# EAGLE design BluetoothModulePCBv2 (EAGLE 8.0.2)
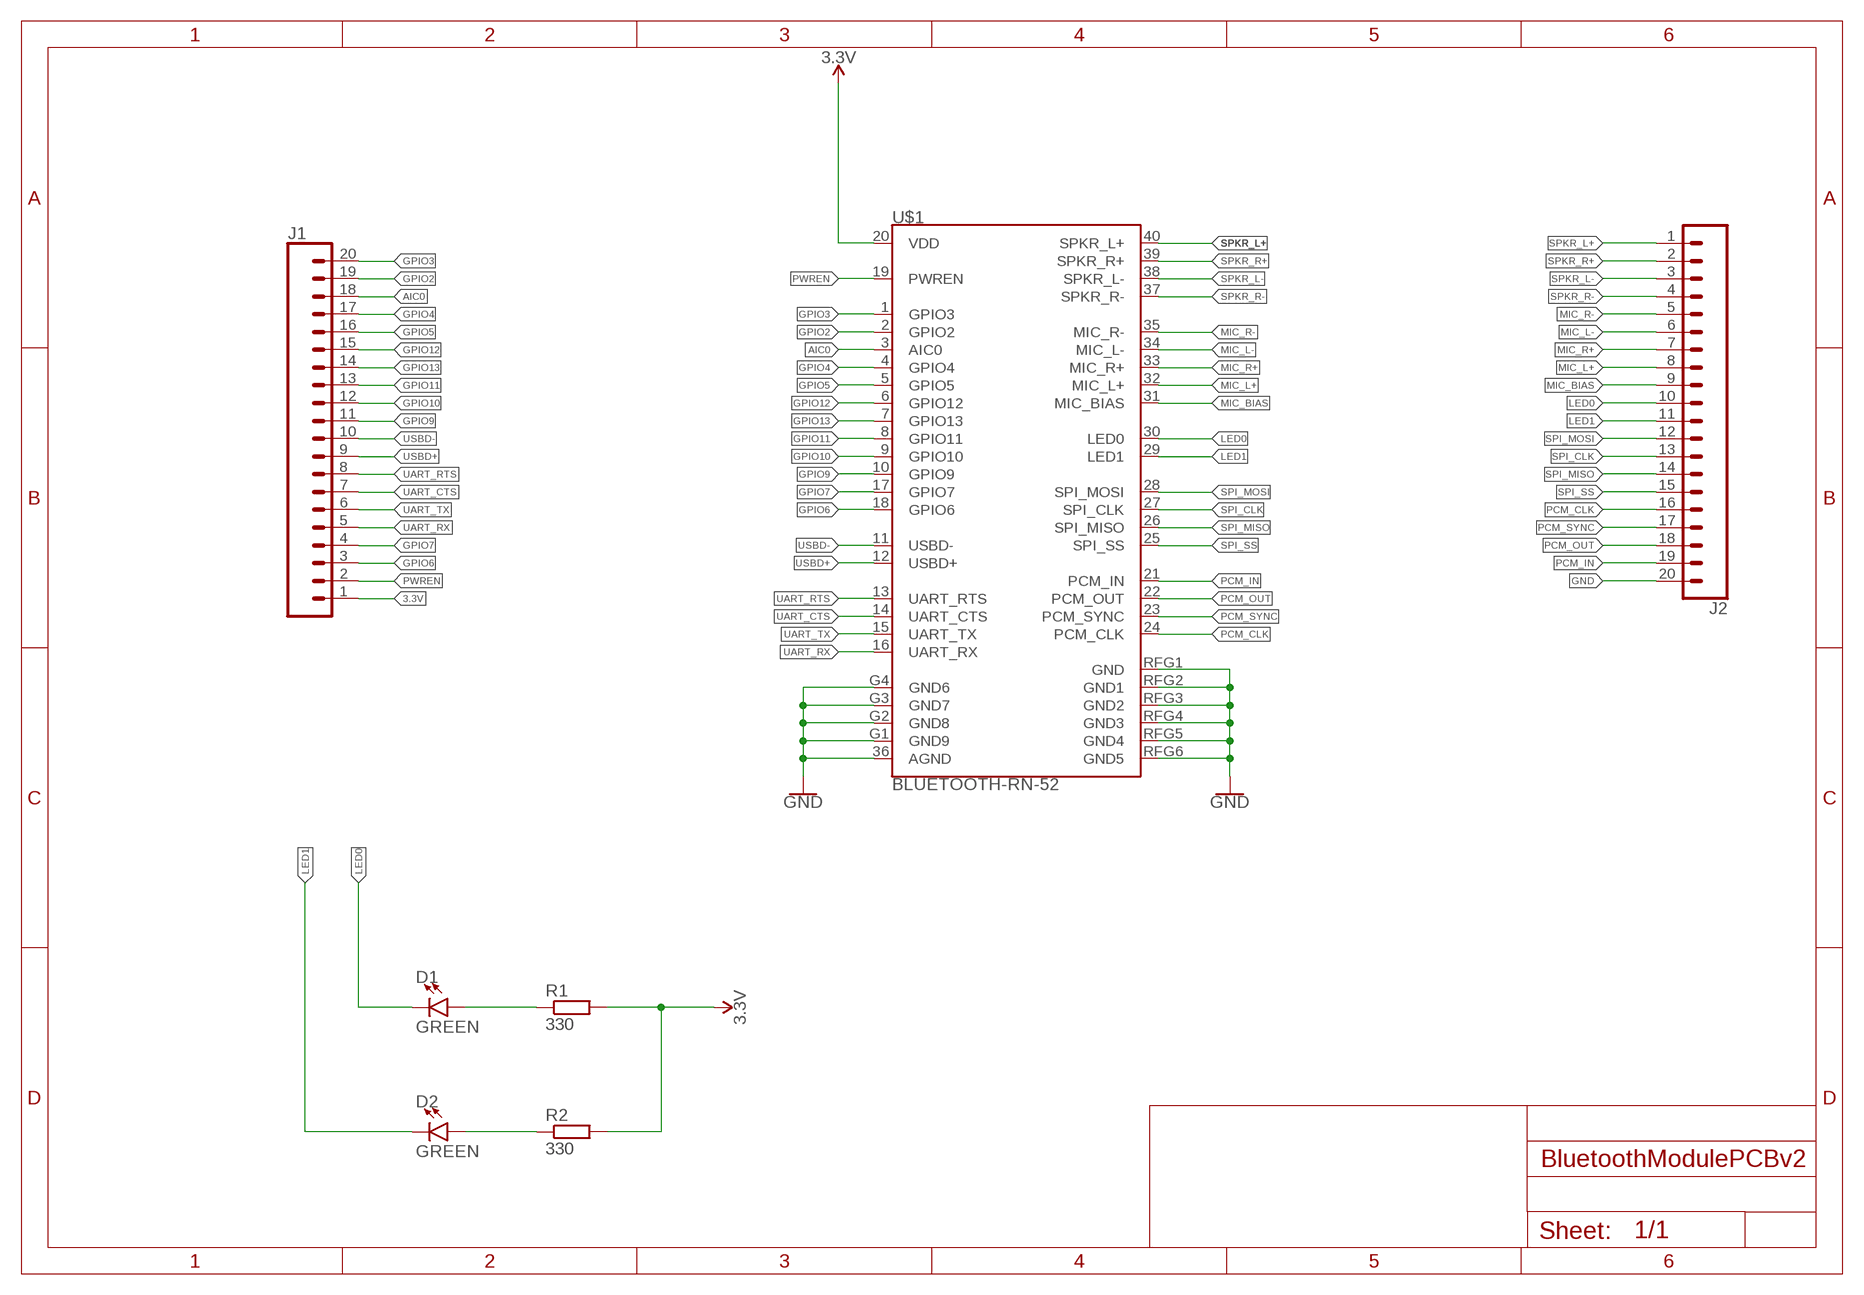
[diagram p0: schematic, sheet 1]

## Parts
D1  GREEN  LED3MM  [LED_3MM]
D2  GREEN  LED3MM  [LED_3MM]
J1  CONN_20  [1X20]
J2  CONN_20  [1X20]
R1  330  R-EU_0204/7  [0204/7]
R2  330  R-EU_0204/7  [0204/7]
U$1  BLUETOOTH-RN-52  [RN-52]

## Nets
3.3V: J1.1 R1.2 R2.2 U$1.20(VDD)
AIC0: J1.18 U$1.3(AIC0)
GND: J2.20 U$1.36(AGND) U$1.G1(GND9) U$1.G2(GND8) U$1.G3(GND7) U$1.G4(GND6) U$1.RFG1(GND) U$1.RFG2(GND1) U$1.RFG3(GND2) U$1.RFG4(GND3) U$1.RFG5(GND4) U$1.RFG6(GND5)
GPIO2: J1.19 U$1.2(GPIO2)
GPIO3: J1.20 U$1.1(GPIO3)
GPIO4: J1.17 U$1.4(GPIO4)
GPIO5: J1.16 U$1.5(GPIO5)
GPIO6: J1.3 U$1.18(GPIO6)
GPIO7: J1.4 U$1.17(GPIO7)
GPIO9: J1.11 U$1.10(GPIO9)
GPIO10: J1.12 U$1.9(GPIO10)
GPIO11: J1.13 U$1.8(GPIO11)
GPIO12: J1.15 U$1.6(GPIO12)
GPIO13: J1.14 U$1.7(GPIO13)
LED0: D1.K(C) J2.10 U$1.30(LED0)
LED1: D2.K(C) J2.11 U$1.29(LED1)
MIC_BIAS: J2.9 U$1.31(MIC_BIAS)
MIC_L+: J2.8 U$1.32(MIC_L+)
MIC_L-: J2.6 U$1.34(MIC_L-)
MIC_R+: J2.7 U$1.33(MIC_R+)
MIC_R-: J2.5 U$1.35(MIC_R-)
N$1: D1.A R1.1
N$2: D2.A R2.1
PCM_CLK: J2.16 U$1.24(PCM_CLK)
PCM_IN: J2.19 U$1.21(PCM_IN)
PCM_OUT: J2.18 U$1.22(PCM_OUT)
PCM_SYNC: J2.17 U$1.23(PCM_SYNC)
PWREN: J1.2 U$1.19(PWREN)
SPI_CLK: J2.13 U$1.27(SPI_CLK)
SPI_MISO: J2.14 U$1.26(SPI_MISO)
SPI_MOSI: J2.12 U$1.28(SPI_MOSI)
SPI_SS: J2.15 U$1.25(SPI_SS)
SPKR_L+: J2.1 U$1.40(SPKR_L+)
SPKR_L-: J2.3 U$1.38(SPKR_L-)
SPKR_R+: J2.2 U$1.39(SPKR_R+)
SPKR_R-: J2.4 U$1.37(SPKR_R-)
UART_CTS: J1.7 U$1.14(UART_CTS)
UART_RTS: J1.8 U$1.13(UART_RTS)
UART_RX: J1.5 U$1.16(UART_RX)
UART_TX: J1.6 U$1.15(UART_TX)
USBD+: J1.9 U$1.12(USBD+)
USBD-: J1.10 U$1.11(USBD-)

## Library data of the parts
D1 D2 = SparkFun-LED:LED: LED (Generic) Standard schematic elements and footprints for 5mm, 3mm, 1206, and 0603 sized LEDs. Generic LEDs with no color specified.; PROD_ID: DIO-08794
J1 J2 = SparkFun-Connectors:CONN_20: Multi connection point. Often used as Generic Header-pin footprint for 0.1 inch spaced/style header connections On any of the 0.1 inch spaced packages, you can populate with these: Break Away Headers - Straight <https://www.sparkfun.com/products/116> (PRT-00116) Break Away Male Headers - Right Angle <https://www.sparkfun.com/products/553> (PRT-00553) Female Headers <https://www.sparkfun.com/products/115> (PRT-00115) Break Away Headers - Machine Pin <https://www.sparkfun.com/products/117> (PRT-00117) Break Away Female Headers - Swiss Machine Pin <https://www.sparkfun.com/products/743> (PRT-00743) For SCREWTERMINALS and SPRING TERMINALS visit here: Screw Terimnals on SparkFun.com <https://www.sparkfun.com/search/results?term=Screw+Terminals> (5mm/3.5mm/2.54mm spacing) This device is also useful as a general connection point to wire up your design to another part of your project. Our various solder wires solder well into these plated through hole pads. Hook-Up Wire - Assortment (Stranded, 22 AWG) <https://www.sparkfun.com/products/11375> (PRT-11375) Hook-Up Wire - Assortment (Solid Core, 22 AWG) <https://www.sparkfun.com/products/11367> (PRT-11367) View the entire wire category on our website here <https://www.sparkfun.com/categories/141> Special notes: Molex polarized connector foot print use with SKU : PRT-08231 with associated crimp pins and housings. 1MM SMD Version SKU: PRT-10208 NOTES ON THE VARIANTS LOCK and LOCK_LONGPADS... This footprint was designed to help hold the alignment of a through-hole component (i.e. 6-pin header) while soldering it into place. You may notice that each hole has been shifted either up or down by 0.005 of an inch from it's more standard position (which is a perfectly straight line). This slight alteration caused the pins (the squares in the middle) to touch the edges of the holes. Because they are alternating, it causes a "brace" to hold the component in place. 0.005 has proven to be the perfect amount of "off-center" position when using our standard breakaway headers. Although looks a little odd when you look at the bare footprint, once you have a header in there, the alteration is very hard to notice. Also,if you push a header all the way into place, it is covered up entirely on the bottom side. Note about LOCK SPECIAL package: This is just like the LOCK variant in that the holes are staggared by 5 mil, but except for the last two holes. They are not altered from the "standard" footprint layout. This is used for a special purpose on the layout of our Graphic LCD Backpack. Make sure you want to use this device before selecting it for you project!
R1 R2 = resistor:R-EU_: RESISTOR, European symbol
U$1 = SparkFun-RF:BLUETOOTH-RN-52: Roving Networks RN-52 Bluetooth Audio Module The RN-52 is an audio module that provides a highly integrated solution for delivering high quality stereo audio in a small form factor with little difficulty. This module is perfect for a project involving hands free audio for your car, remote controlling your media center, or streaming 2-channel audio. SparkFun Products: RN-52 - Bluetooth Audio Module <https://www.sparkfun.com/products/11678> (WRL-11678) Audio Bluetooth Breakout - RN-52 <https://www.sparkfun.com/products/12849> (WRL-12849); PROD_ID: IC-11569; SF_ID: WRL-11678

## Board
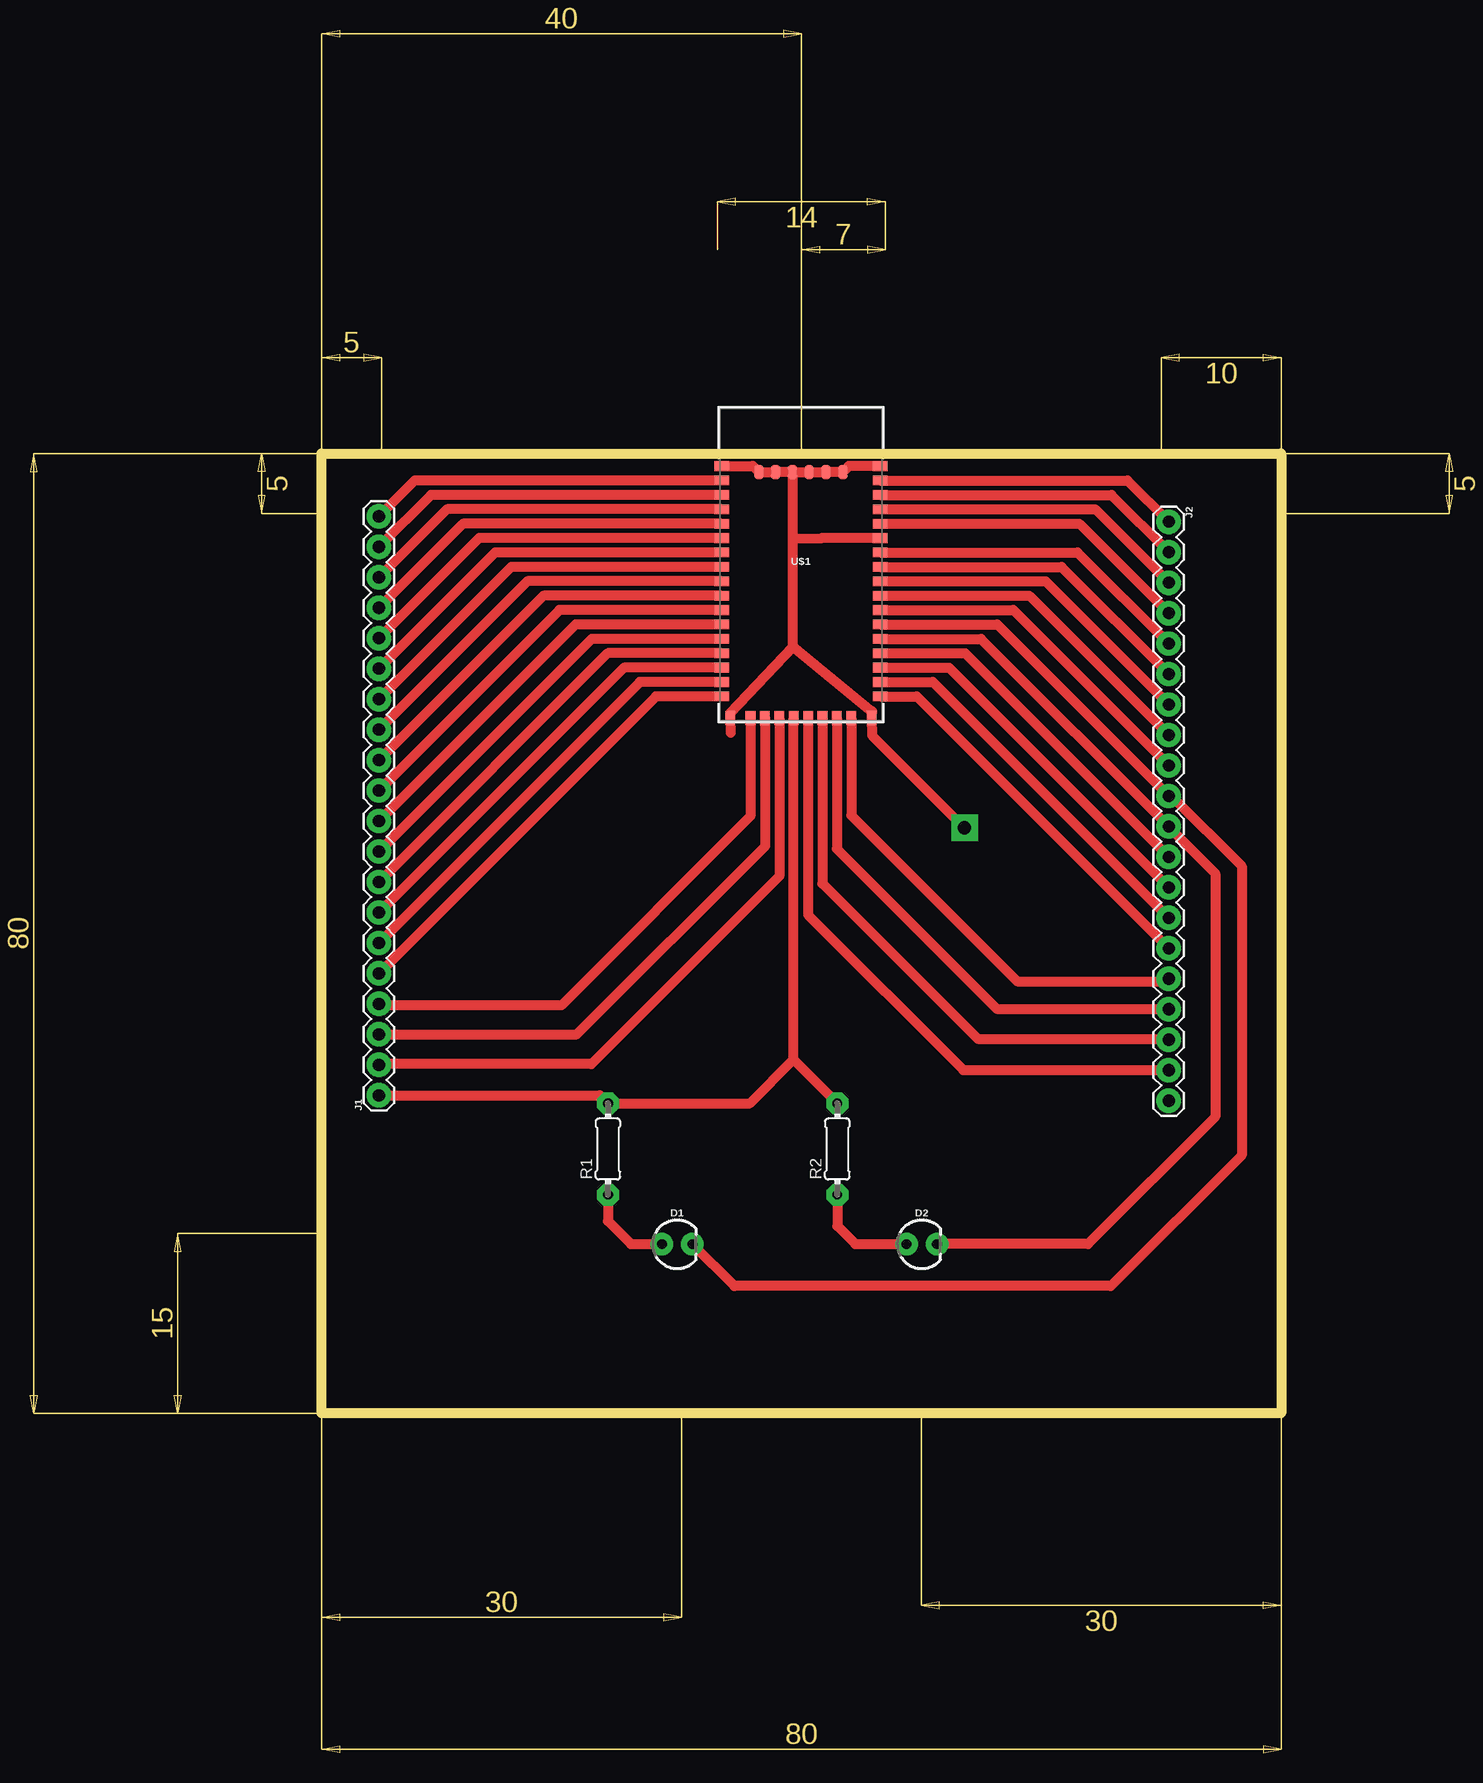
[diagram p1: board, top side]
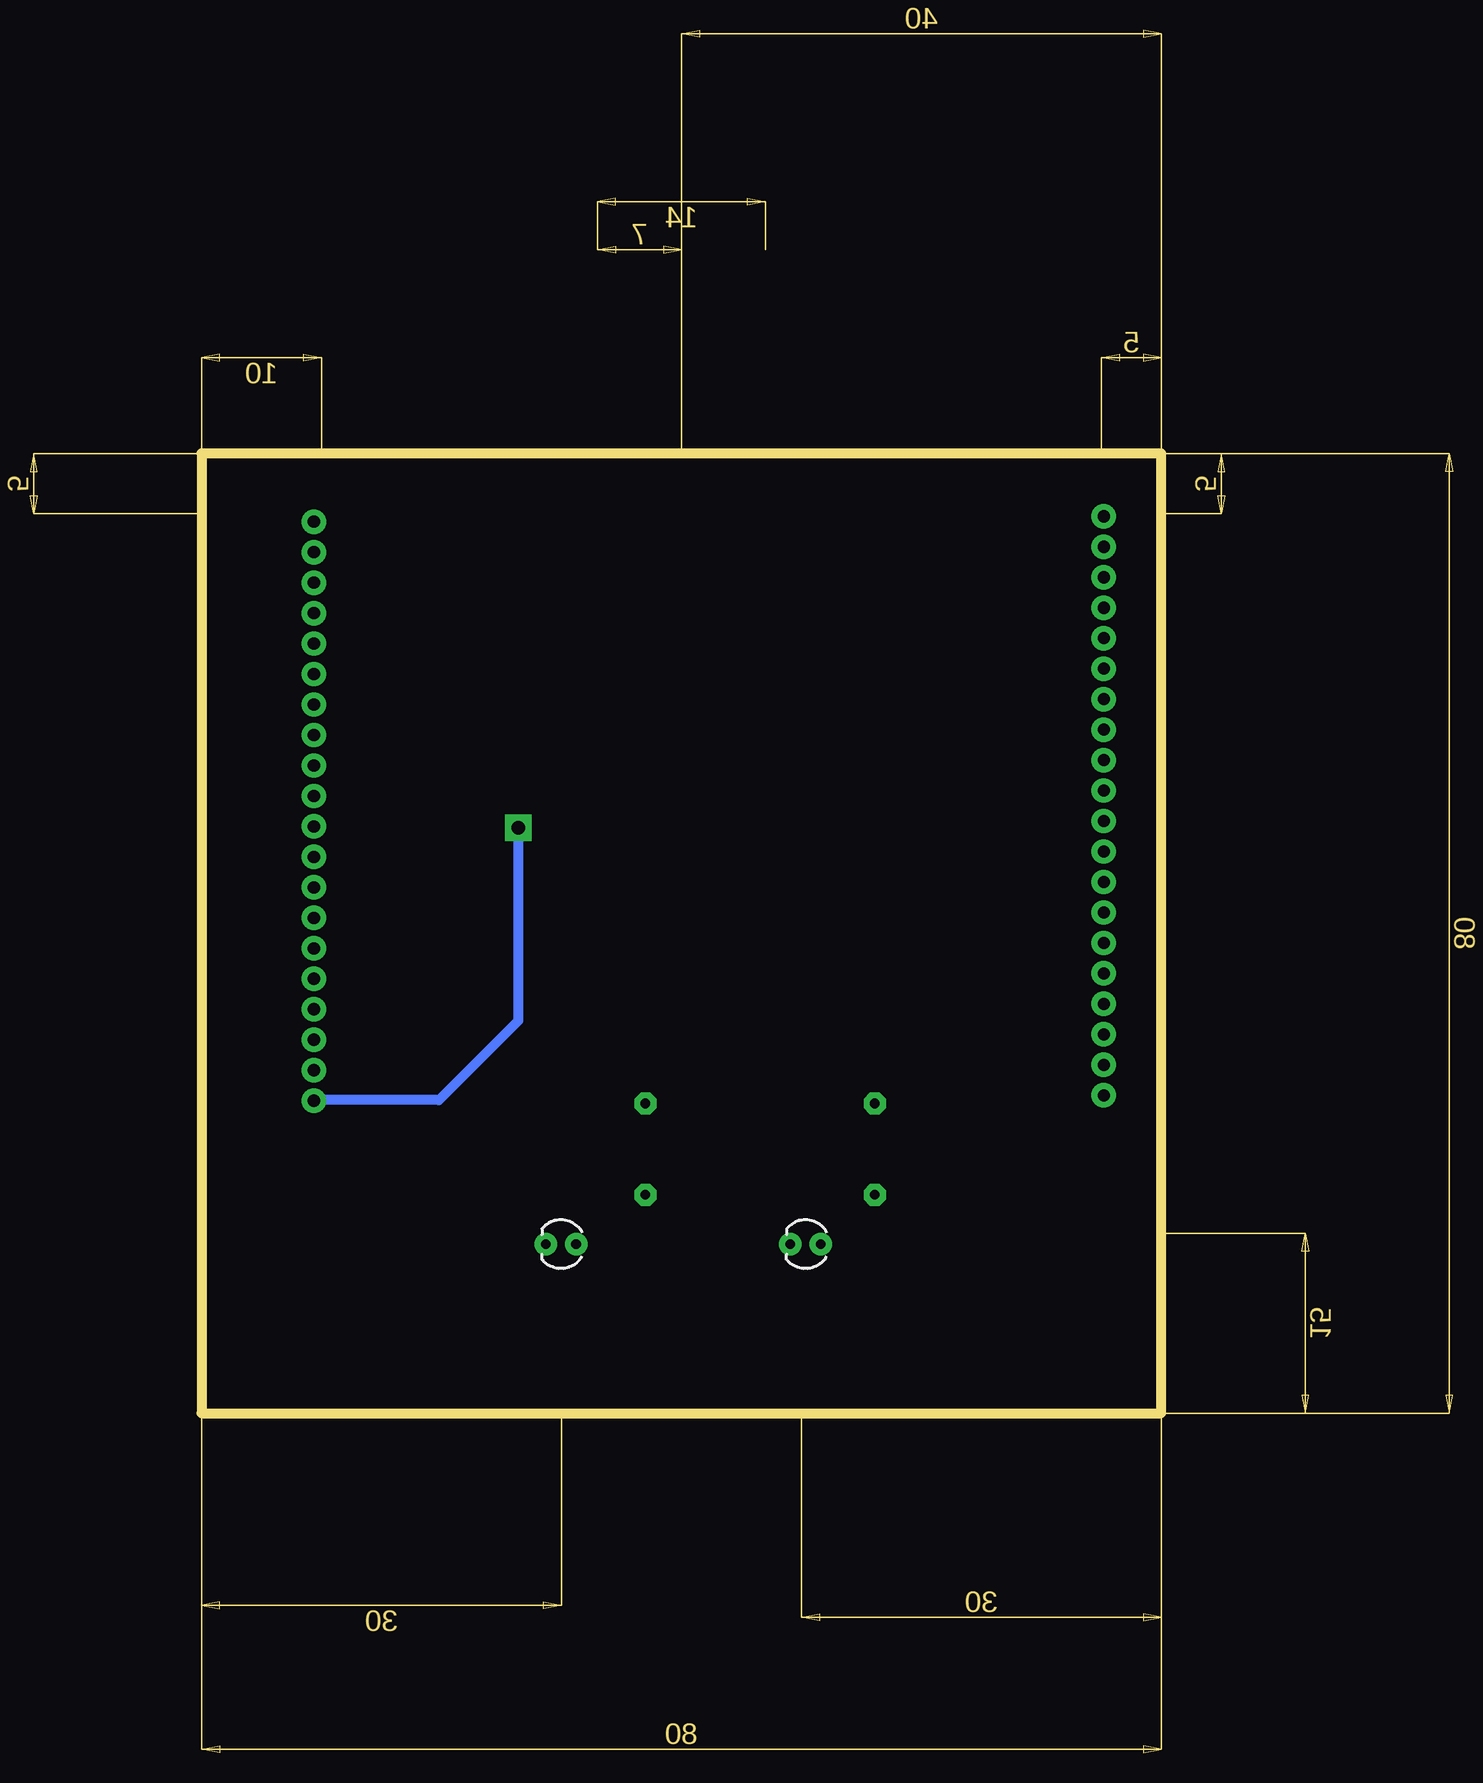
[diagram p2: board, bottom side, seen from below]

Size 80 x 80 mm. Coordinates in mm from the lower left corner, seen from the top.
Outline: 0,0 0,80 80,80 80,0 0,0
Copper layers (1*16): Top 0.035mm / dielectric 1.5mm / Bottom 0.035mm
Design rules "LabE": minimum track width 24mil, minimum drill 0.8mm, track to track 16mil, track to pad 16mil, pad to pad 16mil, via to via 16mil, smd to smd 16mil, copper to edge 0mil, drill to drill 16mil, minimum pad ring 20mil, minimum via ring 20mil, stop-mask expansion 4mil, vias tented up to drill 0mil, thermal gap 10mil

### Footprints (pad centres in the part's own frame; a part is rotated, then mirrored left to right if it is on the bottom)
LED_3MM = drill 0.813 pad 1.88: A -1.27,0; K 1.27,0
1X20 = drill 1.016 pad 1.88: 1 0,0; 2 2.54,0; 3 5.08,0; 4 7.62,0; 5 10.16,0; 6 12.7,0; 7 15.24,0; 8 17.78,0; 9 20.32,0; 10 22.86,0; 11 25.4,0; 12 27.94,0; 13 30.48,0; 14 33.02,0; 15 35.56,0; 16 38.1,0; 17 40.64,0; 18 43.18,0; 19 45.72,0; 20 48.26,0
0204/7 = drill 0.813 octagon: 1 -3.81,0; 2 3.81,0
RN-52 = smd 1.2 x 0.8: 1 -6.6,8.33; 2 -6.6,7.13; 3 -6.6,5.93; 4 -6.6,4.73; 5 -6.6,3.53; 6 -6.6,2.33; 7 -6.6,1.13; 8 -6.6,-0.07; 9 -6.6,-1.27; 10 -6.6,-2.47; 11 -6.6,-3.67; 12 -6.6,-4.87; 13 -6.6,-6.07; 14 -6.6,-7.27; 15 -6.6,-8.47; 16 -6.6,-9.67; 25 6.6,-9.67; 26 6.6,-8.47; 27 6.6,-7.27; 28 6.6,-6.07; 29 6.6,-4.87; 30 6.6,-3.67; 31 6.6,-2.47; 32 6.6,-1.27; 33 6.6,-0.07; 34 6.6,1.13; 35 6.6,2.33; 36 6.6,3.53; 37 6.6,4.73; 38 6.6,5.93; 39 6.6,7.13; 40 6.6,8.33; G1 -6.6,9.53; G4 6.6,9.53 | smd 0.8 x 1.2: 17 -4.2,-11.47; 18 -3,-11.47; 19 -1.8,-11.47; 20 -0.6,-11.47; 21 0.6,-11.47; 22 1.8,-11.47; 23 3,-11.47; 24 4.2,-11.47; G2 -5.9,-11.47; G3 5.9,-11.46; RFG1 -3.5,9.03; RFG2 -2.1,9.03; RFG3 -0.7,9.03; RFG4 0.7,9.03; RFG5 2.1,9.03; RFG6 3.5,9.03

### Placement (x,y rotation side)
D1  29.65,14.09 0 top
D2  50.04,14.09 0 top
J1  4.79,26.5 90 top
J2  70.63,74.31 270 top
R1  23.88,22.02 90 top
R2  43,22.02 90 top
U$1  39.96,69.42 0 top

### Tracks (layer width: path | path; a pad name or v marks a point on that pad's centre or on a via)
3.3V
  Top 0.813: 39.36,29.47 U$1.20 | 39.36,29.47 R2.2 | 39.36,29.47 35.72,25.83 R1.2 23.21,26.5 J1.1
AIC0
  Top 0.813: U$1.3 10.46,75.35 J1.18
GND  (via drill 1.1)
  Top 0.813: U$1.G1 35.96,78.95 U$1.RFG1 U$1.RFG2 U$1.RFG3 | U$1.RFG3 U$1.RFG4 U$1.RFG5 U$1.RFG6 43.96,78.95 U$1.G4 | U$1.36 41.75,72.95 39.3,72.9 | 39.3,72.9 39.3,78.41 U$1.RFG3 | 39.3,63.9 34.06,58.36 U$1.G2 34.1,56.7 | 39.3,63.9 45.9,58.5 45.86,58.14 U$1.G3 45.9,56.5 v53.6,48.8 | 39.3,63.9 39.3,72.9
  Bottom 0.813: v53.6,48.8 53.6,32.7 60.2,26.1 70.58,26.1 J2.20
GPIO2
  Top 0.813: U$1.2 9.12,76.55 J1.19
GPIO3
  Top 0.813: U$1.1 7.78,77.75 J1.20
GPIO4
  Top 0.813: U$1.4 11.8,74.15 J1.17
GPIO5
  Top 0.813: U$1.5 13.14,72.95 J1.16
GPIO6
  Top 0.61: 4.88,31.7 J1.3
  Top 0.813: J1.3 21.28,31.58 37,47.3 37,57.91 U$1.18
GPIO7
  Top 0.61: 35.75,57.88 U$1.17 | J1.4 4.88,34.2
  Top 0.813: U$1.17 35.76,49.76 20,34 4.91,34 J1.4
GPIO9
  Top 0.813: U$1.10 19.84,66.95 J1.11
GPIO10
  Top 0.813: U$1.9 18.5,68.15 J1.12
GPIO11
  Top 0.813: U$1.8 17.16,69.35 J1.13
GPIO12
  Top 0.813: U$1.6 14.48,71.75 J1.15
GPIO13
  Top 0.813: U$1.7 15.82,70.55 J1.14
LED0
  Top 0.813: U$1.30 56.33,65.75 J2.10 70.85,51.45 76.7,45.6 76.7,21.5 65.8,10.6 34.41,10.6 D1.K
LED1
  Top 0.813: U$1.29 54.99,64.55 J2.11 70.63,48.87 74.5,45 74.5,24.7 63.9,14.1 D2.K
MIC_BIAS
  Top 0.813: U$1.31 57.67,66.95 J2.9
MIC_L+
  Top 0.813: U$1.32 59.01,68.15 J2.8
MIC_L-
  Top 0.813: U$1.34 61.69,70.55 J2.6
MIC_R+
  Top 0.813: U$1.33 60.35,69.35 J2.7
MIC_R-
  Top 0.813: U$1.35 63.03,71.75 J2.5
N$1
  Top 0.813: R1.1 23.88,16.02 25.8,14.1 D1.A
N$2
  Top 0.813: R2.1 43,15.6 44.5,14.1 D2.A
PCM_CLK
  Top 0.61: J2.16 70.62,36.25
  Top 0.813: U$1.24 44.16,49.84 58,36 70.42,36 J2.16
PCM_IN
  Top 0.61: U$1.21
  Top 0.813: U$1.21 40.56,41.54 53.5,28.6 J2.19
PCM_OUT
  Top 0.61: J2.18
  Top 0.813: U$1.22 41.76,44.14 54.7,31.2 70.56,31.2 J2.18
PCM_SYNC
  Top 0.813: U$1.23 42.96,47.04 56.3,33.7 70.6,33.7 J2.17
PWREN
  Top 0.61: 38.12,57.88 U$1.19
  Top 0.813: 4.83,29 J1.2 4.85,29.1 22.5,29.1 38.16,44.76 U$1.19
SPI_CLK
  Top 0.813: U$1.27 52.31,62.15 J2.13
SPI_MISO
  Top 0.813: U$1.26 50.97,60.95 J2.14
SPI_MOSI
  Top 0.813: U$1.28 53.65,63.35 J2.12
SPI_SS
  Top 0.813: U$1.25 49.63,59.75 J2.15
SPKR_L+
  Top 0.61: J2.1 70.59,74.35
  Top 0.813: U$1.40 67.19,77.75 J2.1
SPKR_L-
  Top 0.813: U$1.38 64.51,75.35 J2.3
SPKR_R+
  Top 0.813: U$1.39 65.85,76.55 J2.2
SPKR_R-
  Top 0.813: U$1.37 63.17,74.15 J2.4
UART_CTS
  Top 0.813: U$1.14 25.2,62.15 J1.7
UART_RTS
  Top 0.813: U$1.13 23.86,63.35 J1.8
UART_RX
  Top 0.813: U$1.16 27.88,59.75 J1.5
UART_TX
  Top 0.813: U$1.15 26.54,60.95 J1.6
USBD+
  Top 0.813: U$1.12 22.52,64.55 J1.9
USBD-
  Top 0.813: U$1.11 21.18,65.75 J1.10